# Altium schematic sheet Accelerometer.SchDoc
size A; SheetNumber: 4; SheetTotal: 5
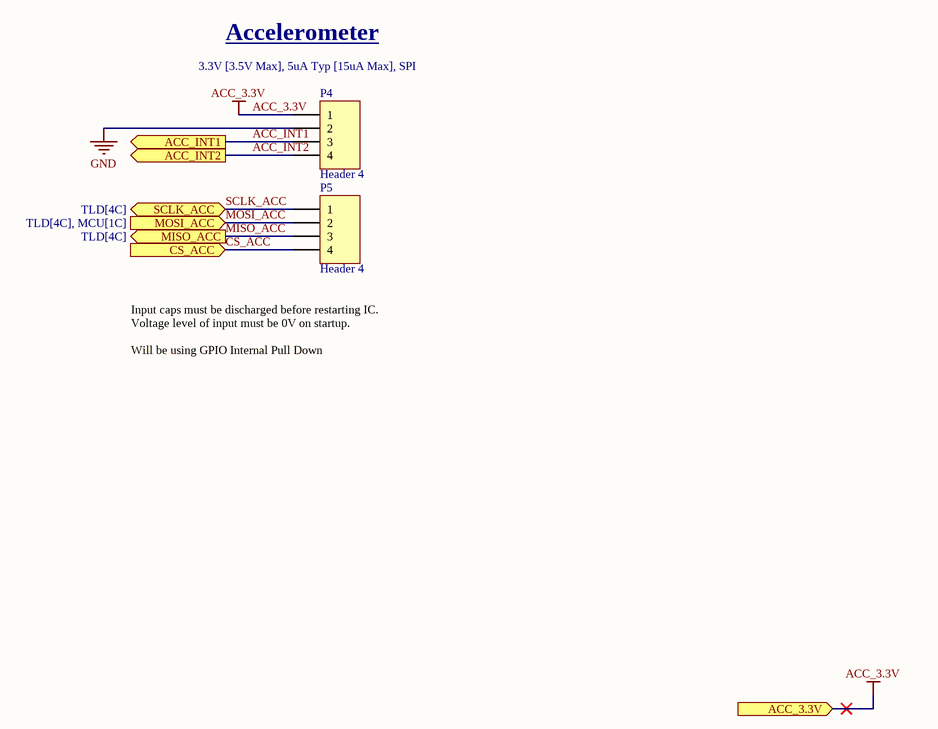
[diagram p0: Accelerometer.SchDoc]

## Parts
P4  Header 4  [HDR1X4]
P5  Header 4  [HDR1X4]

## Ports
ACC_3.3V (in, see TLD[3C], MCU[2A]), ACC_INT1 (out, see TLD[4C], MCU[1B]), ACC_INT2 (out, see TLD[4C], MCU[1B]), CS_ACC (in, see TLD[3C], MCU[1B]), MISO_ACC (out, see TLD[4C]), MOSI_ACC (in, see TLD[4C], MCU[1C]), SCLK_ACC (bidir, see TLD[4C])

## Nets
ACC_3.3V: P4.1 ; port ACC_3.3V
GND: P4.2
ACC_INT1: P4.3 ; port ACC_INT1
ACC_INT2: P4.4 ; port ACC_INT2
CS_ACC: P5.4 ; port CS_ACC
MISO_ACC: P5.3 ; port MISO_ACC
MOSI_ACC: P5.2 ; port MOSI_ACC
SCLK_ACC: P5.1 ; port SCLK_ACC

## Notes on the sheet
- (near P4) 3.3V [3.5V Max], 5uA Typ [15uA Max], SPI
- Accelerometer
- (near P5) Input caps must be discharged before restarting IC.
  Voltage level of input must be 0V on startup.
  Will be using GPIO Internal Pull Down

## Library data of the parts
P4 P5 = Header 4: Header, 4-Pin; LatestRevisionDate: 17-Jul-2002; LatestRevisionNote: Re-released for DXP Platform.; Publisher: Altium Limited